# Altium schematic sheet main.SchDoc
size A3
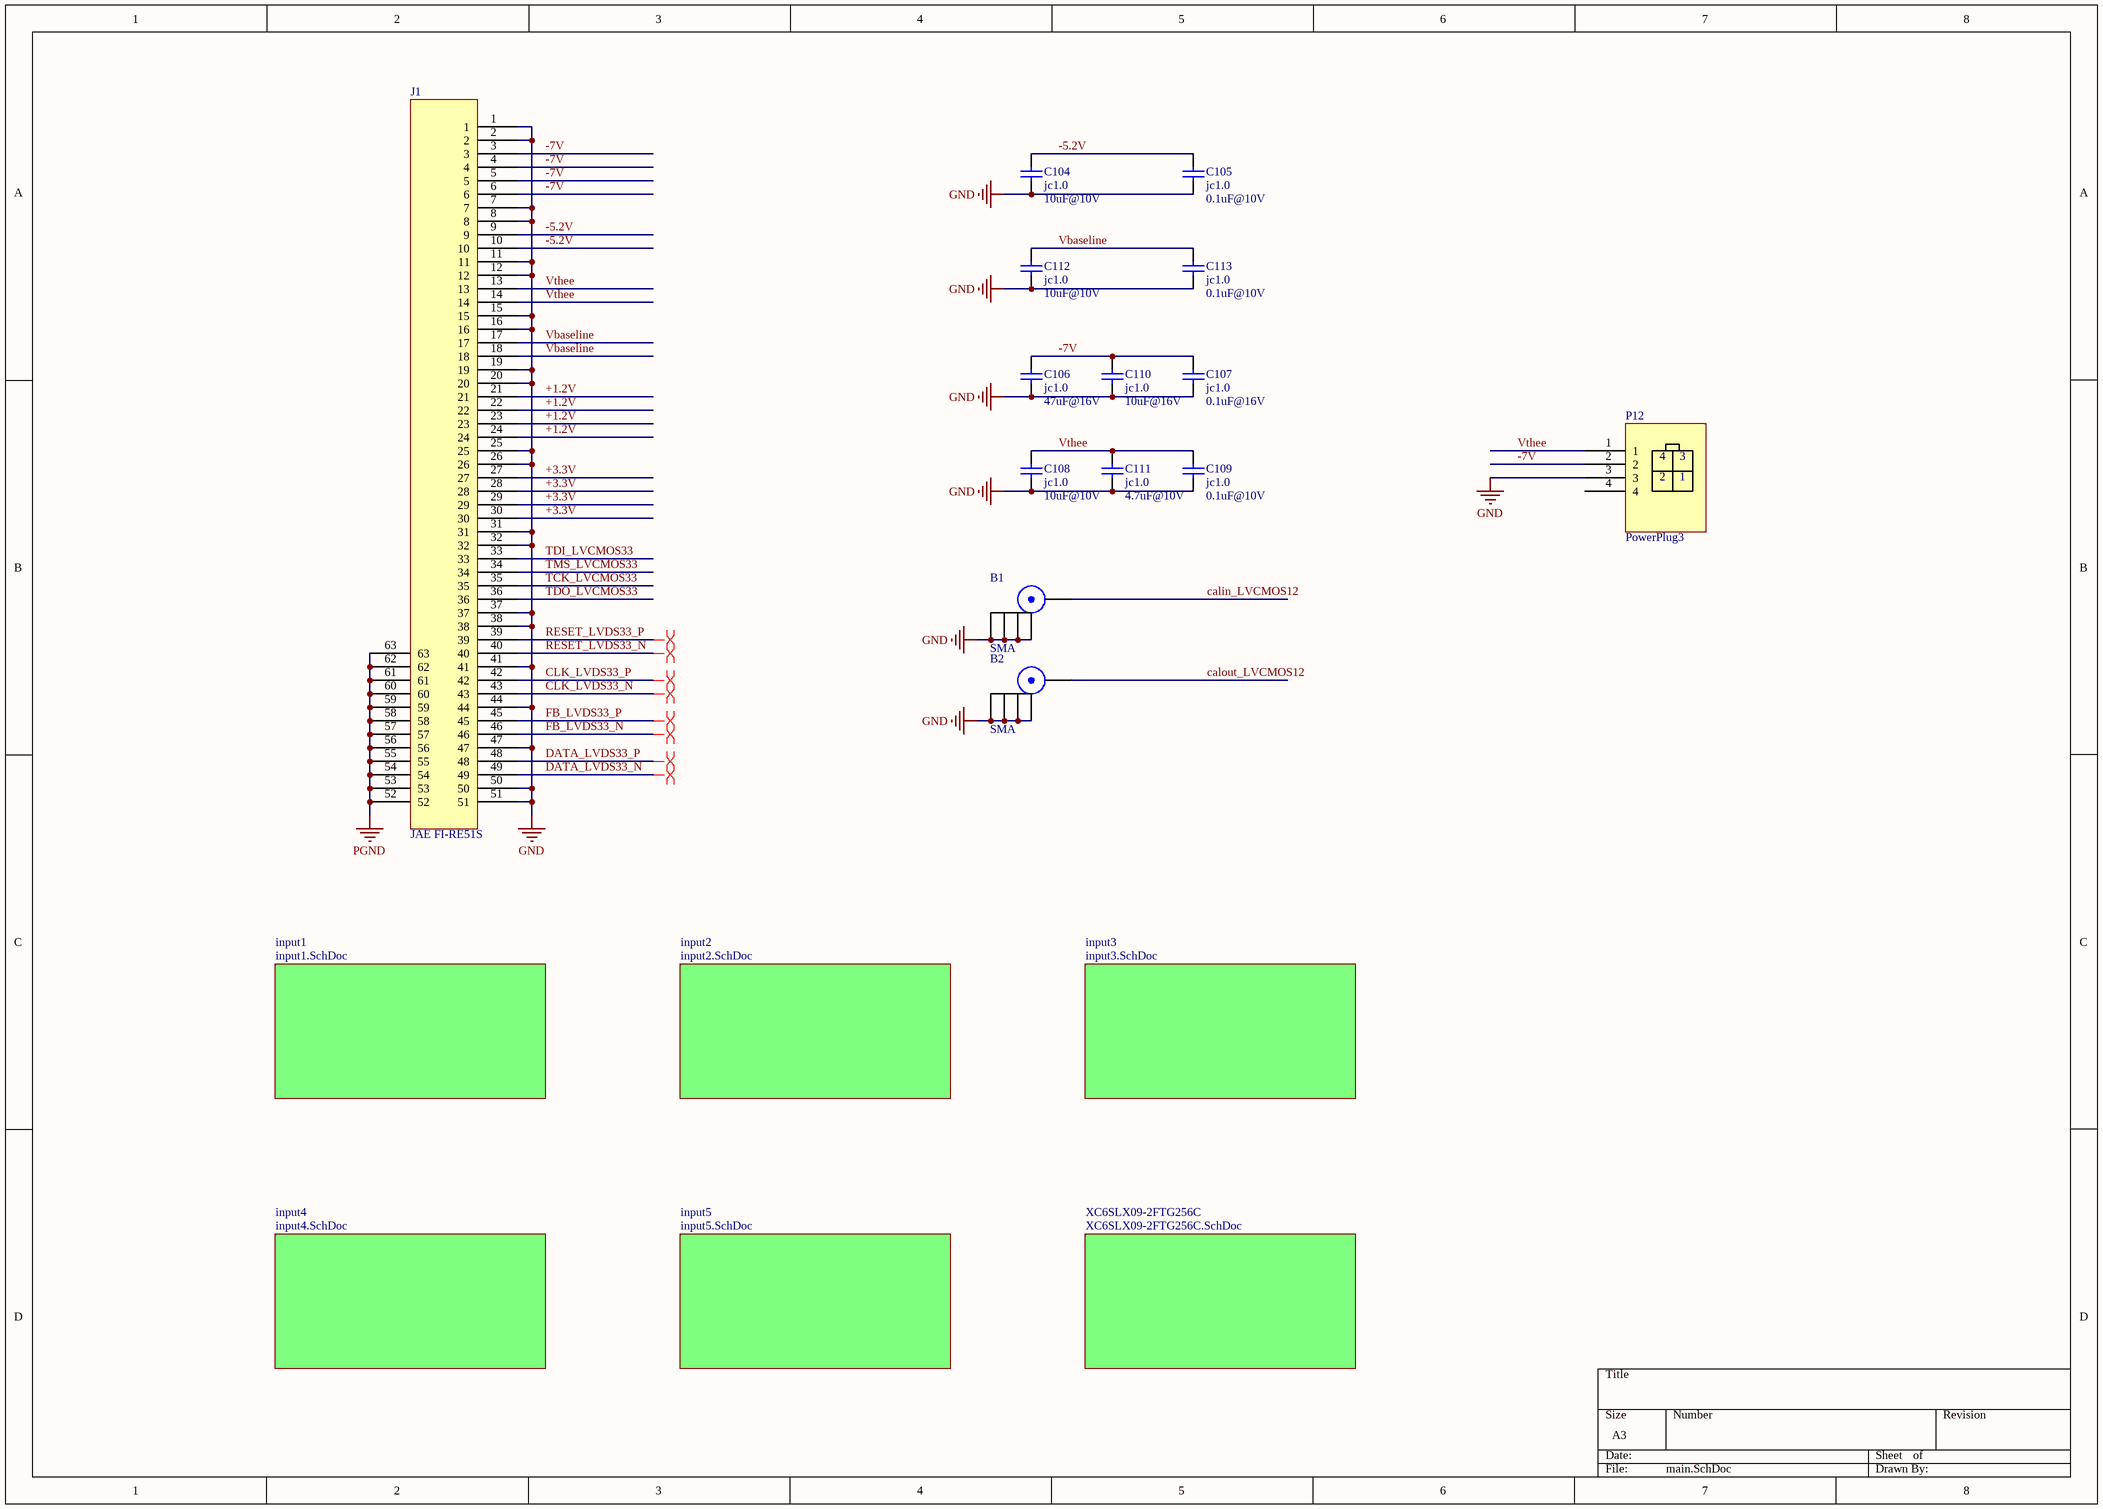
[diagram p0: main.SchDoc]

## Parts
B1  SMA  [SMA_2]
B2  SMA  [SMA_2]
C104  jc1.0  value 10uF@10V  [0805]
C105  jc1.0  value 0.1uF@10V  [0805]
C106  jc1.0  value 47uF@16V  [1210]
C107  jc1.0  value 0.1uF@16V  [0805]
C108  jc1.0  value 10uF@10V  [0805]
C109  jc1.0  value 0.1uF@10V  [0805]
C110  jc1.0  value 10uF@16V  [0805]
C111  jc1.0  value 4.7uF@10V  [0805]
C112  jc1.0  value 10uF@10V  [0805]
C113  jc1.0  value 0.1uF@10V  [0805]
J1  JAE FI-RE51S  [FI-RE51S-HF]
P12  PowerPlug3  [powerplug4]

## Sub-sheets
input1 = input1.SchDoc: no entries
input2 = input2.SchDoc: no entries
input3 = input3.SchDoc: no entries
input4 = input4.SchDoc: no entries
input5 = input5.SchDoc: no entries
XC6SLX09-2FTG256C = XC6SLX09-2FTG256C.SchDoc: no entries

## Nets
GND: B1.2(GND) B1.3(GND) B1.4(GND) B1.5(GND) B2.2(GND) B2.3(GND) B2.4(GND) B2.5(GND) C104.1 C105.1 C106.1 C107.1 C108.1 C109.1 C110.1 C111.1 C112.1 C113.1 J1.1 J1.2 J1.7 J1.8 J1.11 J1.12 J1.15 J1.16 J1.19 J1.20 J1.25 J1.26 J1.31 J1.32 J1.37 J1.38 J1.41 J1.44 J1.47 J1.50 J1.51 P12.3
PGND: J1.52 J1.53 J1.54 J1.55 J1.56 J1.57 J1.58 J1.59 J1.60 J1.61 J1.62 J1.63
+1.2V: J1.21 J1.22 J1.23 J1.24
+3.3V: J1.27 J1.28 J1.29 J1.30
-5.2V: C104.2 C105.2 J1.9 J1.10
-7V: C106.2 C107.2 C110.2 J1.3 J1.4 J1.5 J1.6 P12.2
calin_LVCMOS12: B1.1(X)
calout_LVCMOS12: B2.1(X)
CLK_LVDS33_N: J1.43
CLK_LVDS33_P: J1.42
DATA_LVDS33_N: J1.49
DATA_LVDS33_P: J1.48
FB_LVDS33_N: J1.46
FB_LVDS33_P: J1.45
RESET_LVDS33_N: J1.40
RESET_LVDS33_P: J1.39
TCK_LVCMOS33: J1.35
TDI_LVCMOS33: J1.33
TDO_LVCMOS33: J1.36
TMS_LVCMOS33: J1.34
Vbaseline: C112.2 C113.2 J1.17 J1.18
Vthee: C108.2 C109.2 C111.2 J1.13 J1.14 P12.1

Not connected (* = marked no-connect by the designer): P12 4

## Layout directives
differential pair: CLK_LVDS33_N, CLK_LVDS33_P, DATA_LVDS33_N, DATA_LVDS33_P, FB_LVDS33_N, FB_LVDS33_P, RESET_LVDS33_N, RESET_LVDS33_P

## Library data of the parts
C104-C113 = Cap: Capacitor; Published: 8-Jun-2000; LatestRevisionDate: 17-Jul-2002; LatestRevisionNote: Re-released for DXP Platform.; PackageReference: RAD-0.3; Publisher: Altium Limited
P12 = PowerPlug4